# Altium schematic sheet ArduinoUnoShield.SchDoc
size A4; Revision: 0
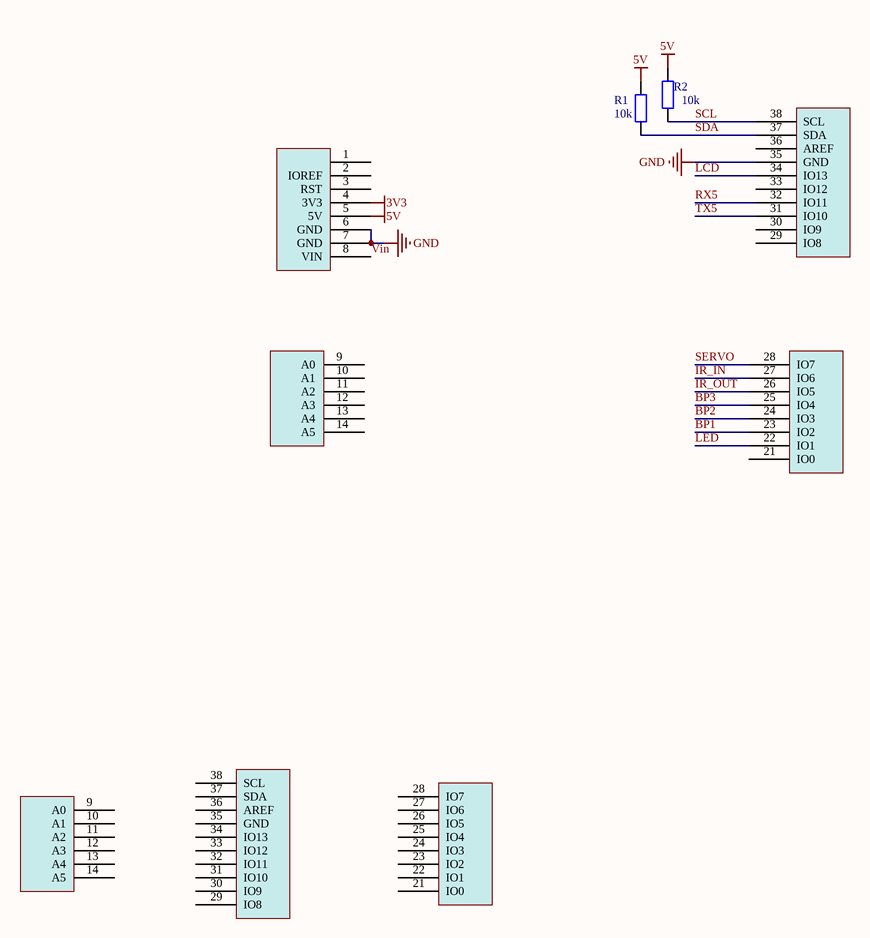
[diagram p0: ArduinoUnoShield.SchDoc]

## Parts
P1  UNO4NUCLEO  [UNO4NUCLEO]  (value not drawn)  (parts A,B,C,D of 4)
P1B  UNO4NUCLEO  [UNO4NUCLEO]  (value not drawn)  (part B of 4)
P1C  UNO4NUCLEO  [UNO4NUCLEO]  (value not drawn)  (part D of 4)  (mechanical)
P1D  UNO4NUCLEO  [UNO4NUCLEO]  (value not drawn)  (part C of 4)  (mechanical)
R1  10k  [0805-R]
R2  10k  [0805-R]

## Nets
3V3: P1.4(3V3)
5V: P1.5(5V) R1.1 R2.1
GND: P1.6(GND) P1.7(GND) P1.35(GND)
BP1: P1.23(IO2)
BP2: P1.24(IO3)
BP3: P1.25(IO4)
IR_IN: P1.27(IO6)
IR_OUT: P1.26(IO5)
LCD: P1.34(IO13)
LED: P1.22(IO1)
RX5: P1.32(IO11)
SCL: P1.38(SCL) R2.2
SDA: P1.37(SDA) R1.2
SERVO: P1.28(IO7)
TX5: P1.31(IO10)
Vin: P1.8(VIN)

Not connected (* = marked no-connect by the designer): P1 1(8) 2(IOREF) 3(RST) 9(A0) 10(A1) 11(A2) 12(A3) 13(A4) 14(A5) 21(IO0) 29(IO8) 30(IO9) 33(IO12) 36(AREF); P1B 9(A0) 10(A1) 11(A2) 12(A3) 13(A4) 14(A5); P1C 29(IO8) 30(IO9) 31(IO10) 32(IO11) 33(IO12) 34(IO13) 35(GND) 36(AREF) 37(SDA) 38(SCL); P1D 21(IO0) 22(IO1) 23(IO2) 24(IO3) 25(IO4) 26(IO5) 27(IO6) 28(IO7)

## Notes on the sheet
- Title
- Size:
- Date:
- A4
- Number:
- Time:
- Revision:
- Sheet
- of
- File:

## Library data of the parts
P1 P1B P1C P1D = UNO4NUCLEO: Header mâle, Carte-à-carte, 2.54 mm, 1 Rangée(s), 10 Contact(s), Traversant, droit, Série 2211S; Fabricant: MULTICOMP PRO; Fournisseur: Farnell; RefFabricant: 2211S-10G; RefFournisseur: 1593417; Valeur: 10 cts
R1 R2 = Res: Résistance à puce CMS, 10 kohm, ± 1%, 250 mW, 0805 [2012 Metric], Couche épaisse, Haute puissance; Fabricant: MULTICOMP PRO; Fournisseur: Farnell; RefFabricant: MCWF08P1002FTL; RefFournisseur: 2694096; Voltage: 150V; Revision: July-2002: Re-released for DXP Platform.; Valeur: 10k